# EAGLE design DotMatrix8x8 (EAGLE 7.5.0)
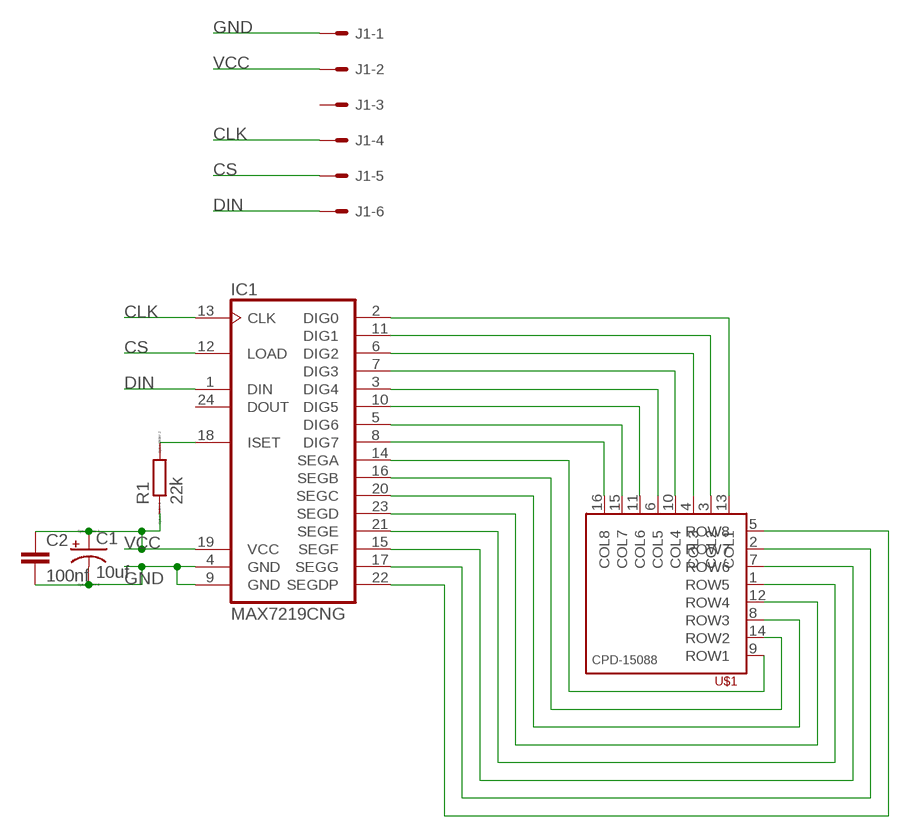
[diagram p0: schematic, sheet 1]

## Parts
C1  10uf  CPOL-USE2.5-6  [E2,5-6]
C2  100nf  C-EU025-025X050  [C025-025X050]
IC1  MAX7219CNG  [DIL24-3]
J1  22-27-2061-06  [6410-06]
R1  22k  R0207/10  [0207/10]
U$1  CPD-15088YGD2/A  [CPD15088]

## Nets
CLK: IC1.13(CLK) J1.4
CS: IC1.12(LOAD) J1.5
DIN: IC1.1(DIN) J1.6
GND: C1.- C2.2 IC1.4(GND) IC1.9(GND) J1.1
N$1: IC1.18(ISET) R1.2
N$2: IC1.2(DIG0) U$1.13(COL1)
N$3: IC1.11(DIG1) U$1.3(COL2)
N$4: IC1.6(DIG2) U$1.4(COL3)
N$5: IC1.7(DIG3) U$1.10(COL4)
N$6: IC1.3(DIG4) U$1.6(COL5)
N$7: IC1.10(DIG5) U$1.11(COL6)
N$8: IC1.5(DIG6) U$1.15(COL7)
N$9: IC1.8(DIG7) U$1.16(COL8)
N$10: IC1.14(SEGA) U$1.9(ROW1)
N$11: IC1.16(SEGB) U$1.14(ROW2)
N$12: IC1.20(SEGC) U$1.8(ROW3)
N$13: IC1.23(SEGD) U$1.12(ROW4)
N$14: IC1.21(SEGE) U$1.1(ROW5)
N$15: IC1.15(SEGF) U$1.7(ROW6)
N$16: IC1.17(SEGG) U$1.2(ROW7)
N$17: IC1.22(SEGDP) U$1.5(ROW8)
VCC: C1.+ C2.1 IC1.19(VCC) J1.2 R1.1
Unconnected: IC1.24(DOUT) J1.3

## Library data of the parts
C1 = resistor:CPOL-US: POLARIZED CAPACITOR, American symbol
C2 = resistor:C-EU: CAPACITOR, European symbol
IC1 = max7219:MAX7219CNG: LED DISPLAY DRIVER; MF: MAXIM; MPN: MAX7219CNG; OC_FARNELL: 1523914; OC_NEWARK: 34C4018
J1 = con-molex:22-?-06: CONNECTOR wire to board 2.54 mm (.1 inch) pitch header; OC_FARNELL: unknown; OC_NEWARK: unknown
R1 = eagle-ltspice:R: RESISTOR, European symbol; SPICEMODEL: NONE; SPICEPREFIX: R
U$1 = LED:CPD-15088: CPD-15088A YGD2/A Green 8x8 LED matrix

## Board
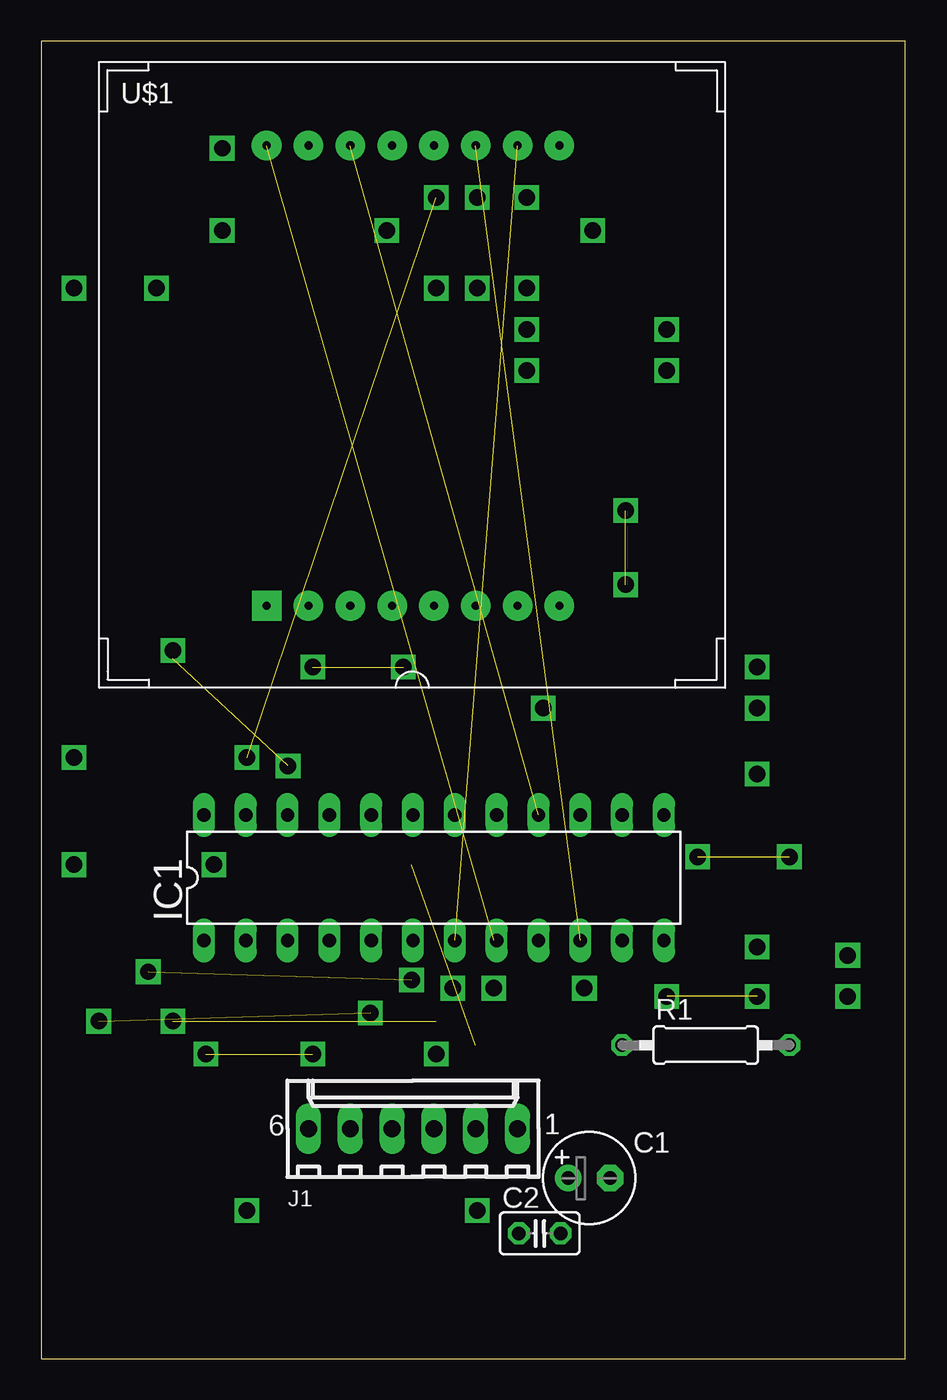
[diagram p1: board, top side]
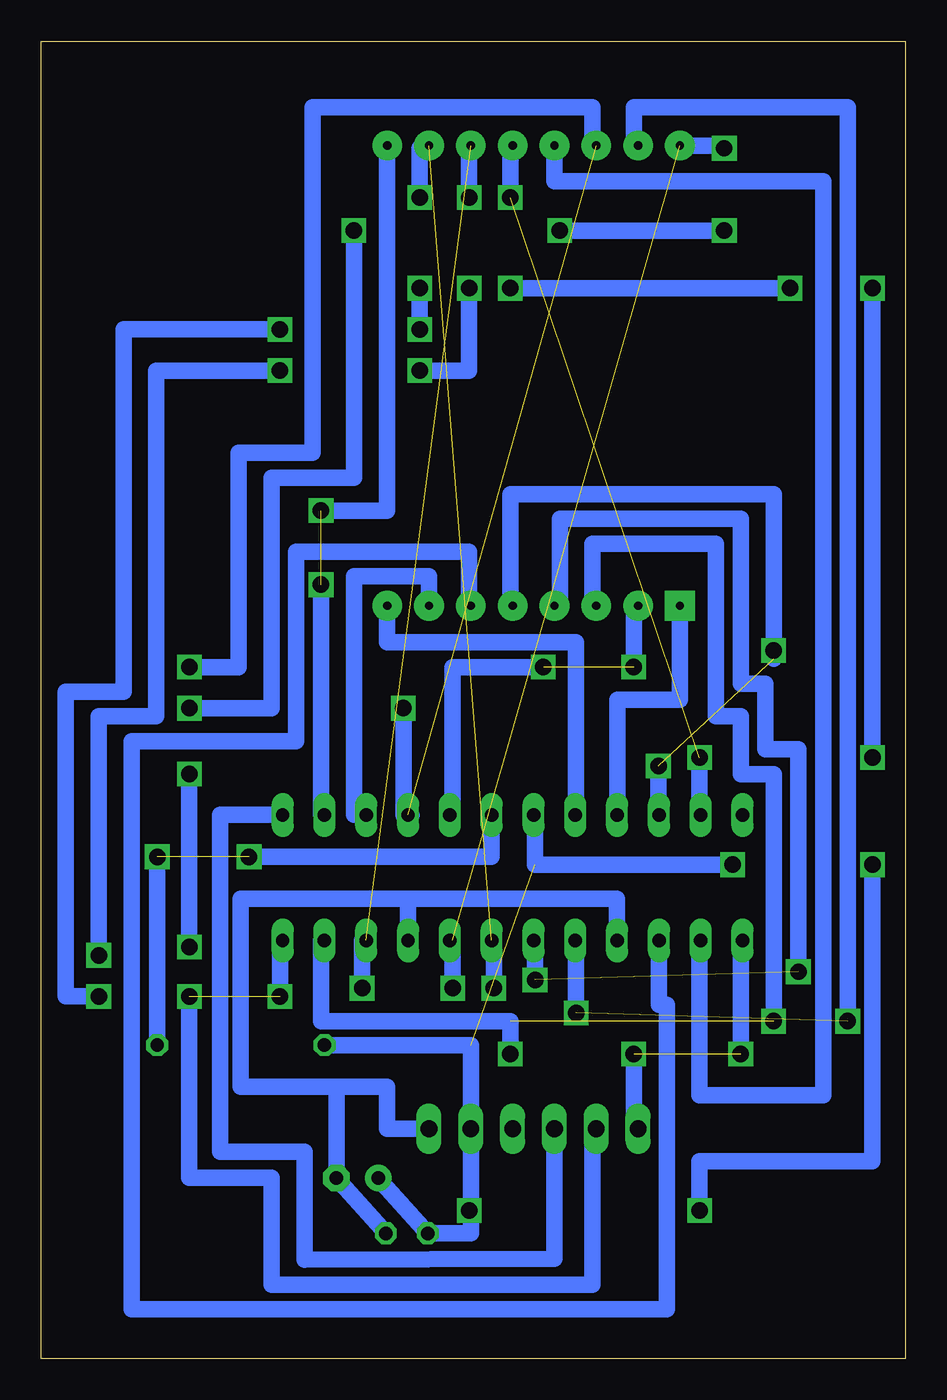
[diagram p2: board, bottom side, seen from below]

Size 52.5 x 80 mm. Coordinates in mm from the lower left corner, seen from the top.
Outline: 0,0 52.5,0 52.5,80 0,80 0,0
Copper layers (1*16): Top 0.035mm / dielectric 1.5mm / Bottom 0.035mm
Design rules "default": minimum track width 10mil, minimum drill 24mil, track to track 8mil, track to pad 8mil, pad to pad 8mil, via to via 8mil, smd to smd 8mil, copper to edge 40mil, drill to drill 8mil, minimum pad ring 10mil, minimum via ring 8mil, stop-mask expansion 4mil, vias tented up to drill 0mil, thermal gap 10mil

### Footprints (pad centres in the part's own frame; a part is rotated, then mirrored left to right if it is on the bottom)
E2,5-6 = drill 0.813 pad 1.6: + -1.27,0 | drill 0.813 pad 1.6 octagon: - 1.27,0
C025-025X050 = drill 0.813 octagon: 1 -1.27,0; 2 1.27,0
DIL24-3 = drill 0.813 long: 1 -13.97,-3.81; 2 -11.43,-3.81; 3 -8.89,-3.81; 4 -6.35,-3.81; 5 -3.81,-3.81; 6 -1.27,-3.81; 7 1.27,-3.81; 8 3.81,-3.81; 9 6.35,-3.81; 10 8.89,-3.81; 11 11.43,-3.81; 12 13.97,-3.81; 13 13.97,3.81; 14 11.43,3.81; 15 8.89,3.81; 16 6.35,3.81; 17 3.81,3.81; 18 1.27,3.81; 19 -1.27,3.81; 20 -3.81,3.81; 21 -6.35,3.81; 22 -8.89,3.81; 23 -11.43,3.81; 24 -13.97,3.81
6410-06 = drill 1.016 long: 1 6.35,0; 2 3.81,0; 3 1.27,0; 4 -1.27,0; 5 -3.81,0; 6 -6.35,0
0207/10 = drill 0.813 octagon: 1 -5.08,0; 2 5.08,0
CPD15088 = drill 0.5 pad 1.8 square: 1 10.16,-33.02 | drill 0.5 pad 1.8: 2 12.7,-33.02; 3 15.24,-33.02; 4 17.78,-33.02; 5 20.32,-33.02; 6 22.86,-33.02; 7 25.4,-33.02; 8 27.94,-33.02; 9 27.94,-5.08; 10 25.4,-5.08; 11 22.86,-5.08; 12 20.32,-5.08; 13 17.78,-5.08; 14 15.24,-5.08; 15 12.7,-5.08; 16 10.16,-5.08

### Placement (x,y rotation side)
C1  33.29,10.97 0 top
C2  30.29,7.62 0 top
IC1  23.86,29.21 0 top
J1  22.59,13.97 0 top
R1  40.37,19.05 0 top
U$1  3.54,78.74 0 top

### Tracks (layer width: path | path; a pad name or v marks a point on that pad's centre or on a via)
CLK
  Bottom 1.016: J1.4 21.32,6.08 36.5,6 36.5,12.58 41.64,12.58 41.64,33.02 IC1.13
CS  (1 unrouted)
  Bottom 1.016: IC1.12 38,25.4 38,22 | J1.5 19,13.97 19,4.5 38.5,4.5 38.5,11 43.5,11 43.5,22
DIN  (1 unrouted)
  Bottom 1.016: J1.6 16.5,13.97 16.5,18.5 | IC1.1 10,25.4 10,18.5
GND
  Bottom 1.016: IC1.4 17.51,27.94 30.21,27.94 | C2.2 C1.- 34.56,16.51 | J1.1 31.48,13.97 31.48,16.51 34.56,16.51 | IC1.9 30.21,27.94 | 30.21,27.94 40.37,27.94 40.37,16.51 34.56,16.51
N$1  (via drill 1 pad 1.27)  (1 unrouted)
  Bottom 1.016: IC1.18 25.13,30.48 v39.87,30.48 | R1.2 45.45,30.48
N$2
  Bottom 1.016: IC1.2 12.5,25.4 12.5,16 5,16 5,71.5 21.32,71.5 U$1.13
N$3  (via drill 1 pad 1.27)  (1 unrouted)
  Bottom 1.016: U$1.3 19,45.72 19,49.5 11.5,49.5 11.5,39 10,39 10,35.5 8,35.5 v8,20.5 | IC1.11 35.5,25.4 35.5,20.5 24,20.5 24,18.5
N$4  (via drill 1 pad 1.27)  (1 unrouted)
  Bottom 1.016: U$1.4 21,45.72 21,51 10,51 10,41 8.5,41 8.5,37 6.5,37 v6.5,23.5 | IC1.6 22.5,25.4 22.5,23
N$5  (1 unrouted)
N$6
  Bottom 1.016: U$1.6 26.5,45.72 26.5,49 37,49 37,37.5 47,37.5 47,3 14.5,3 14.5,21.5 14.97,21.5 IC1.3
N$7  (1 unrouted)
  Bottom 1.016: IC1.10 33,25.4 33,22.5
N$8  (1 unrouted)
  Bottom 1.016: IC1.5 20,25.4 20,21 | U$1.15 16.5,73.66 16.5,76 3.5,76 3.5,20.5
N$9  (via drill 1 pad 1.27)  (1 unrouted)
  Bottom 1.016: IC1.8 27.5,25.4 27.5,22.5 | U$1.16 11,73.66 v11,73.5
N$10  (via drill 1 pad 1.27)  (1 unrouted)
  Bottom 1.016: IC1.14 35.5,33.02 v35.5,47 | U$1.9 31.5,73.66 31.5,51.5 35.5,51.5
N$11  (1 unrouted)
N$12
  Bottom 1.016: IC1.20 20,33.02 20,43.5 31.48,43.5 U$1.8
N$13  (via drill 1 pad 1.27)  (1 unrouted)
  Bottom 1.016: IC1.23 12.5,33.02 v12.5,36.5 | U$1.12 24,73.66 24,70.5
N$14
  Bottom 1.016: IC1.21 17.5,40 13.7,40 U$1.1
N$15
  Bottom 1.016: IC1.15 33.5,33.02 33.5,47.5 28.94,47.5 U$1.7
N$16  (via drill 1 pad 1.27)  (1 unrouted)
  Bottom 1.016: U$1.2 16.5,45.72 v16.5,42 | IC1.17 27.5,33.02 27.5,42 22,42
N$17  (via drill 1 pad 1.27)  (1 unrouted)
  Bottom 1.016: U$1.5 24,45.72 24,52.5 8,52.5 v8,43 8,42.5 | IC1.22 15,33.02 15,36
N$18  (via drill 1 pad 1.27)
  other vias: 45.45,30.48
N$19  (via drill 1 pad 1.27)
  other vias: 43.5,22
N$20  (via drill 1 pad 1.27)
  other vias: 38,22
N$21  (via drill 1 pad 1.27)
  other vias: 22,42
N$22  (via drill 1 pad 1.27)
  other vias: 24,18.5
N$23  (via drill 1 pad 1.27)
  other vias: 16.5,18.5
N$24  (via drill 1 pad 1.27)
  other vias: 10,18.5
N$25  (via drill 1 pad 1.27)
  other vias: 22.5,23
N$26  (via drill 1 pad 1.27)
  other vias: 15,36
N$27  (via drill 1 pad 1.27)
  other vias: 35.5,51.5
N$28  (via drill 1 pad 1.27)
  other vias: 20,21
N$29  (via drill 1 pad 1.27)
  other vias: 3.5,20.5
N$30  (via drill 1 pad 1.27)
  other vias: 27.5,22.5
N$31  (via drill 1 pad 1.27)
  Bottom 1.016: v43.5,25 v43.5,35.5
N$32  (via drill 1 pad 1.27)
  Bottom 1.016: 29,73.5 29.5,73.5 v29.5,70.5
N$33  (via drill 1 pad 1.27)
  Bottom 1.016: 26.5,73.5 v26.5,70.5
N$34  (via drill 1 pad 1.27)
  Bottom 1.016: v11,68.5 v21,68.5
N$36  (via drill 1 pad 1.27)
  Bottom 1.016: v33.5,68.5 33.5,53.5 38.5,53.5 38.5,39.5 v43.5,39.5
N$37  (via drill 1 pad 1.27)
  Bottom 1.016: 30,33 30.5,33 v30.5,39.5
N$38  (via drill 1 pad 1.27)
  Bottom 1.016: 19,73.5 19,76 36,76 36,55 40.5,55 40.5,42 v43.5,42
N$39  (via drill 1 pad 1.27)
  Bottom 1.016: v29.5,65 v29.5,62.5
N$41  (via drill 1 pad 1.27)
  Bottom 1.016: v2,65 v2,36.5
N$42  (via drill 1 pad 1.27)
  Bottom 1.016: v24,65 9,65 v7,65
N$43  (via drill 1 pad 1.27)
  other vias: 24,70.5
N$44  (via drill 1 pad 1.27)
  other vias: 2,30
N$45  (via drill 1 pad 1.27)
  other vias: 26.5,9
N$46  (via drill 1 pad 1.27)
  Bottom 1.016: v29.5,60 26.5,60 v26.5,65
N$47  (via drill 1 pad 1.27)
  Bottom 1.016: 2,29.5 2,12 12.5,12 v12.5,9
N$48  (via drill 1 pad 1.27)
  Bottom 1.016: v25,22.5 25,25.5
N$49  (via drill 1 pad 1.27)
  other vias: 33,22.5
N$50  (via drill 1 pad 1.27)
  Bottom 1.016: v49,22 51,22 51,40.5 47.5,40.5 47.5,62.5 v38,62.5
N$51  (via drill 1 pad 1.27)
  Bottom 1.016: v49,24.5 49,39 45.5,39 45.5,60 v38,60
VCC  (via drill 1 pad 1.27)  (1 unrouted)
  Bottom 1.016: R1.1 26.4,19.05 J1.2 26.4,7.62 C2.1 C1.+ | IC1.19 22.5,33.02 22.5,30 v10.5,30